# EAGLE design wireless-dong-mk-2.1 (EAGLE 6.5.0)
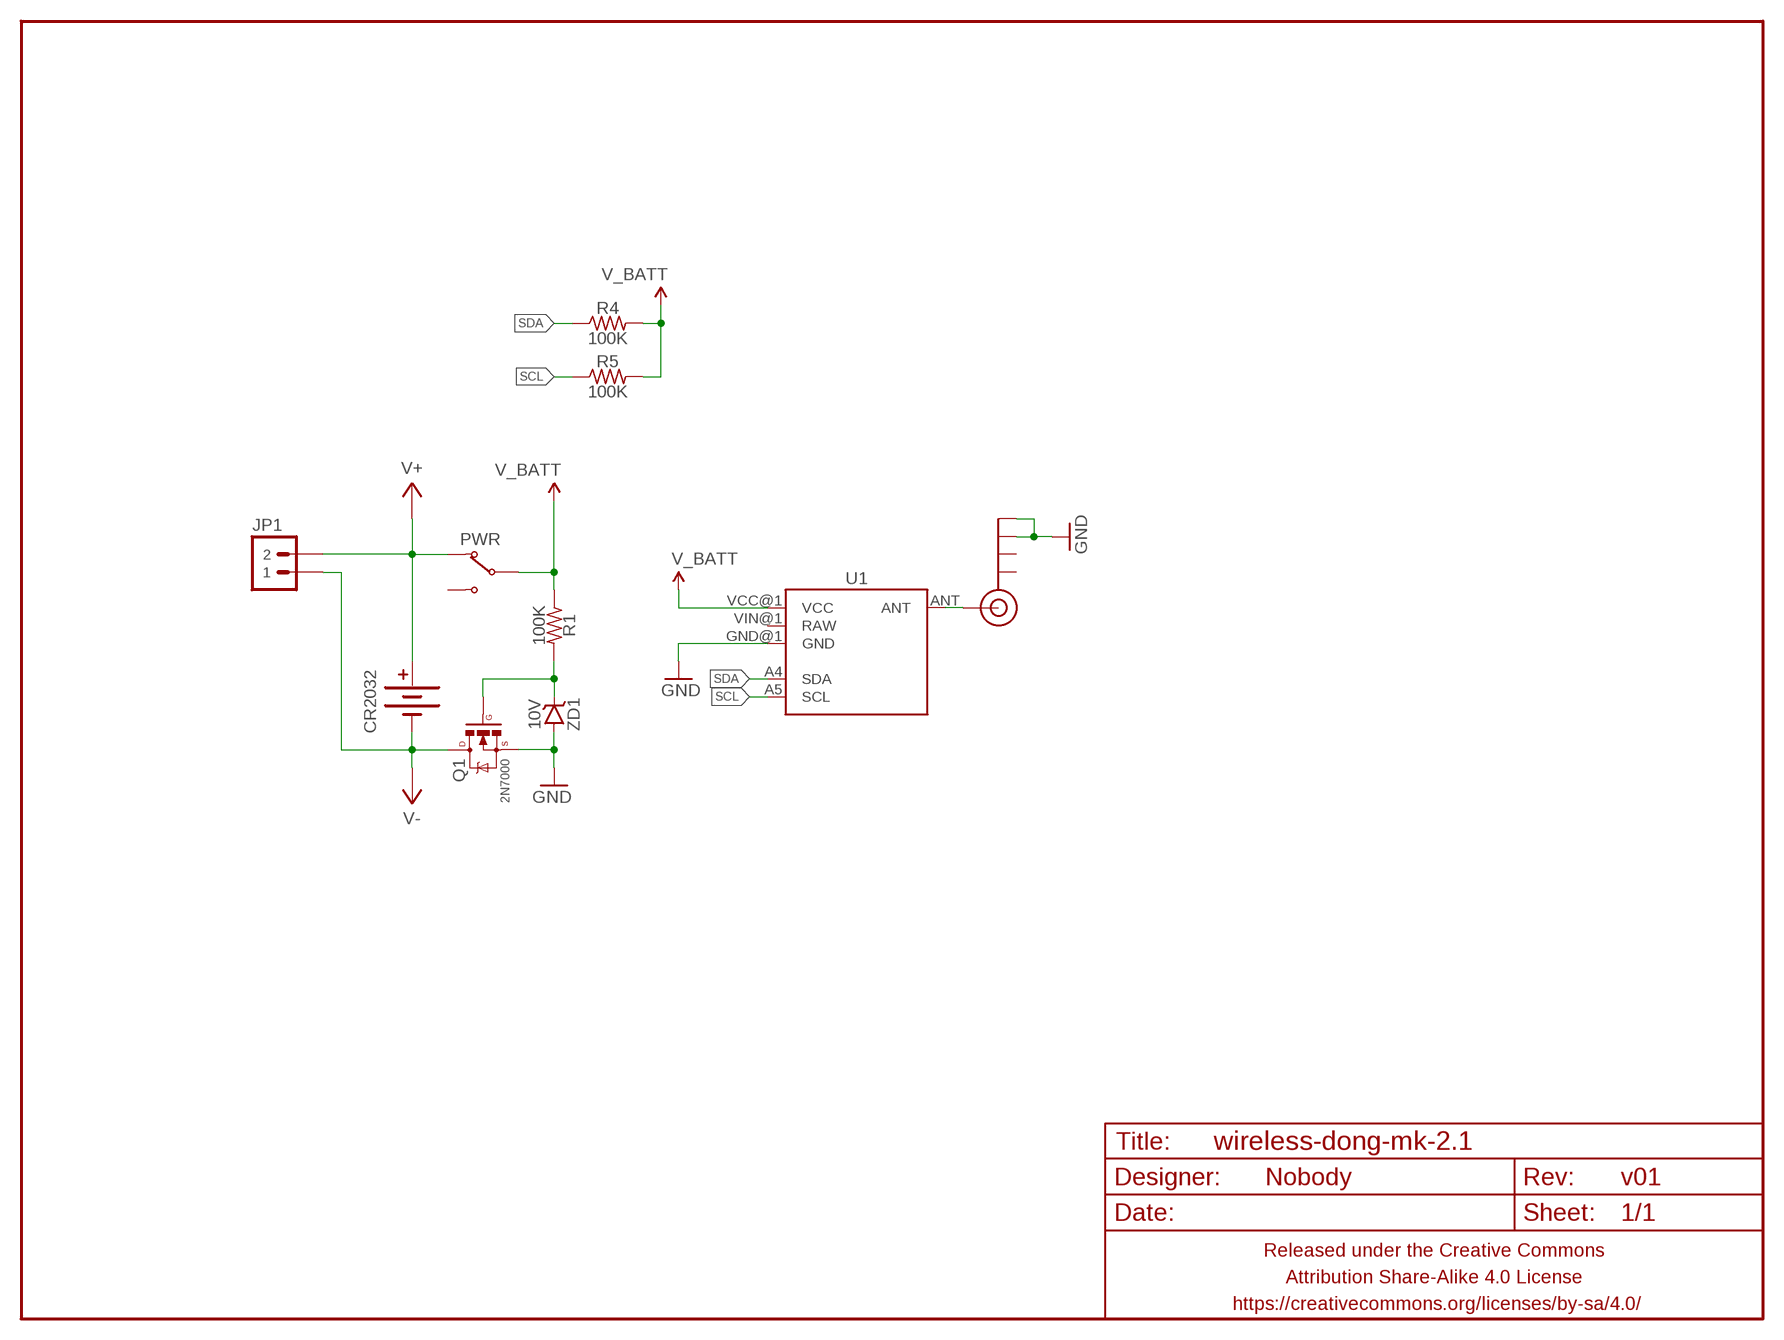
[diagram p0: schematic, sheet 1]

## Parts
ANT  SMA_EDGE  [SMA-EDGE]
CR2032  BATTERY20PTH_TOPLOAD  [BATTCON_20MM_PTH_TOPLOAD]
FRAME1  FRAME-LETTERNO_PACKAGE  [DUMMY]
JP1  M02PTH-CENTERED-R+  [1X02-CENTER-R+]
PWR  SWITCH-SPDTPTH-RA-2.54MM  [SPDT-RA-2.54MM]
Q1  2N7000  MOSFET-NCHANNELIRLML2502  [SOT23]
R1  100K  RESISTORR0603  [R0603]
R4  100K  RESISTORR0603  [R0603]
R5  100K  RESISTORR0603  [R0603]
U1  MOTEINO_BOAT  [MOTEINO_BOAT]
ZD1  10V  DIODE-ZENERSOT23  [SOT23]

## Nets
GND: ANT.GND@2(GND) ANT.GND@3(GND) Q1.2(S) U1.GND@1(GND) ZD1.1(A) ZD1.2(A)
N$1: Q1.1(G) R1.2 ZD1.3(C)
N$2: ANT.SIG(SIGNAL) U1.ANT
SCL: R5.1 U1.A5(SCL)
SDA: R4.1 U1.A4(SDA)
V+: CR2032.+ JP1.2 PWR.1(NC)
V-: CR2032.- JP1.1 Q1.3(D)
V_BATT: PWR.2(COM) R1.1 R4.2 R5.2 U1.VCC@1(VCC)
Unconnected: ANT.GND@0(GND) ANT.GND@1(GND) PWR.3(NO) U1.VIN@1(RAW)

## Library data of the parts
ANT = A_butts:SMA_EDGE: SMA Antenna Connector End launch SMA connector. The paste layer has been removed so that the connector can be hand soldered onto the board after reflow.
CR2032 = A_butts:BATTERY: Battery Holders Various common sizes : AA, AAA, 20mm coin cell and 12mm coin cell. 20MM_4LEGS, BATT-10373
FRAME1 = A_butts:FRAME-LETTER: Schematic Frame Standard 8.5x11 US Letter frame; DESIGNER: Nobody; VERSION: v01
JP1 = A_butts:M02: Standard 2-pin 0.1" header. Use with - straight break away headers ( PRT-00116) - right angle break away headers (PRT-00553) - swiss pins (PRT-00743) - machine pins (PRT-00117) - female headers (PRT-00115) Molex polarized connector foot print use with: PRT-08233 with associated crimp pins and housings. 2.54_SCREWTERM for use with PRT-10571. 3.5mm Screw Terminal footprints for PRT-08084 5mm Screw Terminal footprints for use with PRT-08433
PWR = A_butts:SWITCH-SPDT
Q1 = A_butts:MOSFET-NCHANNEL: Common NMOSFET Parts MFG P/N Store ID Prod ID FDD8780 TRANS-09984 SI7820DN TRANS-11055 FDS6630A IC-08089 2N7002PW TRANS-11151 FQP30N06L COM-10213 TRANS-10060 BSS123LT1G TRANS-08345 BSS138 TRANS-00830 BS170 2N7000
R1 R4 R5 = A_butts:RESISTOR: RESISTOR, American symbol
U1 = A_butts:MOTEINO_BOAT
ZD1 = A_butts:DIODE-ZENER: Zener Diode Production Part - 8199 3.4V Zener Voltage

## Board
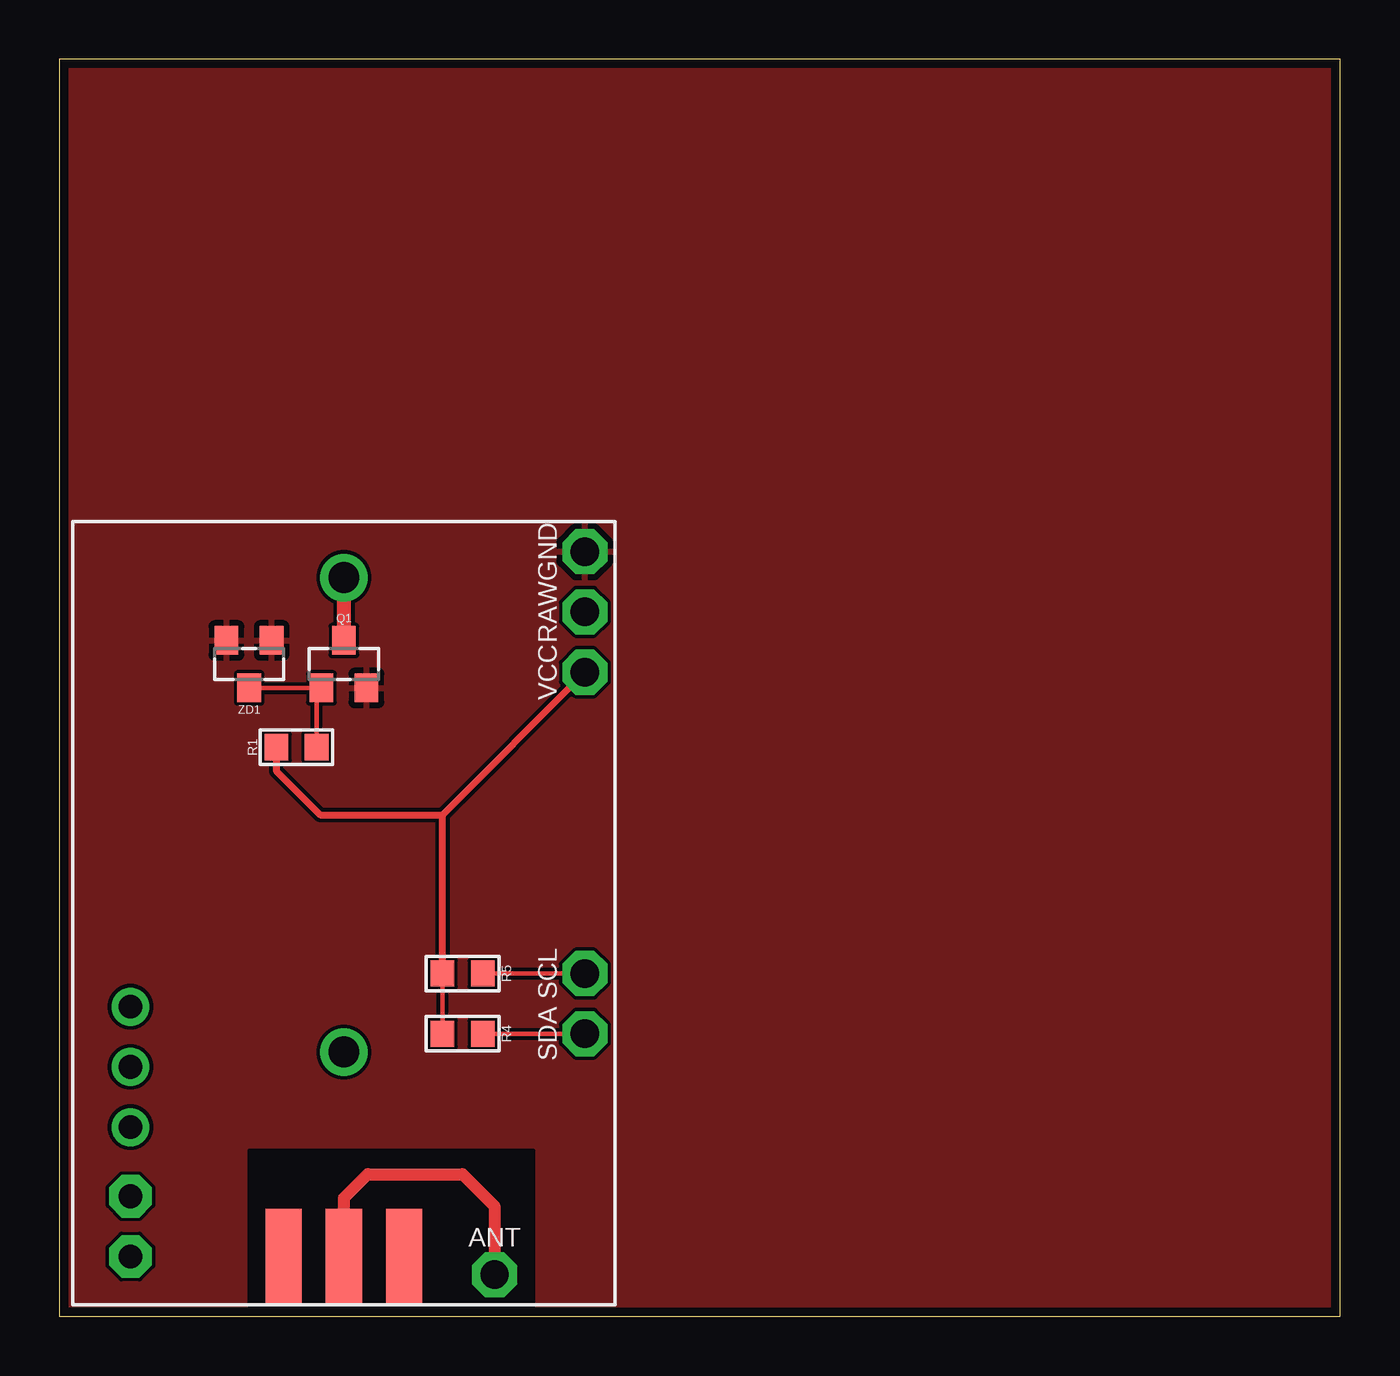
[diagram p1: board, top side]
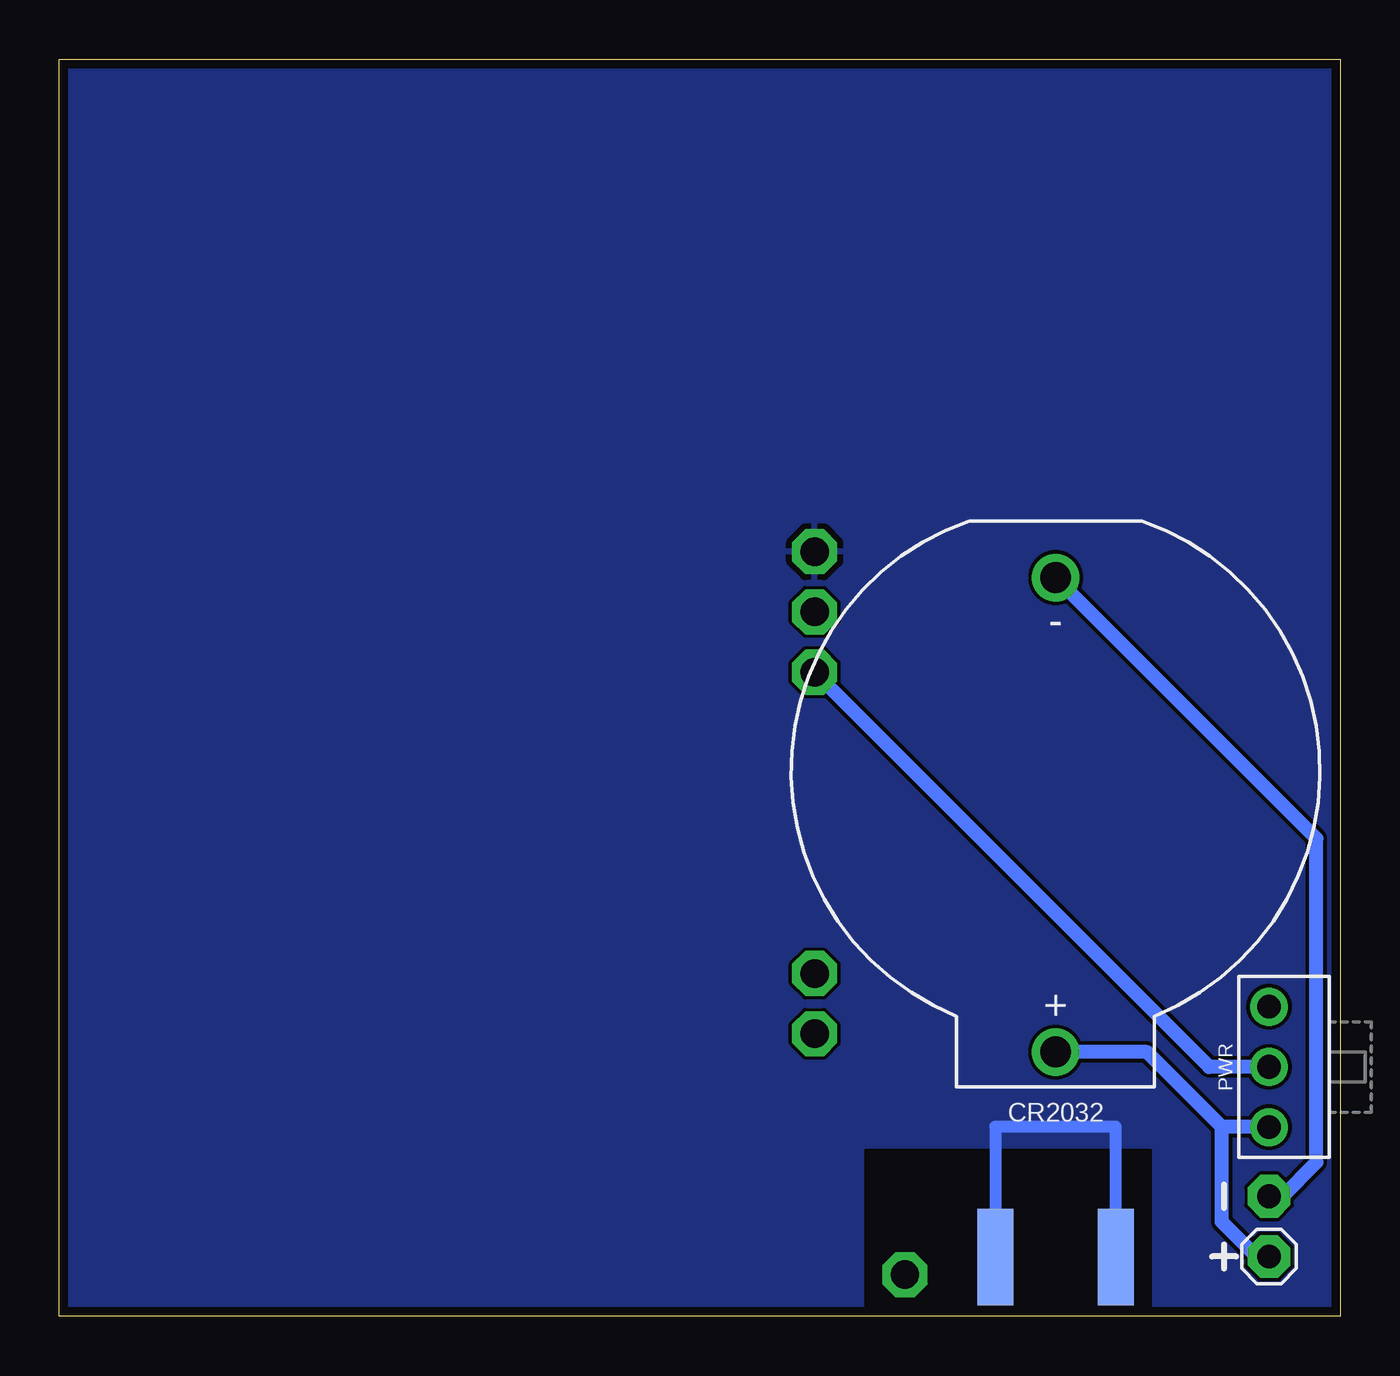
[diagram p2: board, bottom side, seen from below]

Size 54 x 53 mm. Coordinates in mm from the lower left corner, seen from the top.
Outline: 0,0 54,0 54,53 0,53 0,0
Copper layers (1*16): Top 0.0356mm / dielectric 1.5011mm / Bottom 0.0356mm
Design rules "LaenPCBOrder_2": minimum track width 6mil, minimum drill 13mil, track to track 6mil, track to pad 6mil, pad to pad 6mil, via to via 6mil, smd to smd 6mil, copper to edge 15mil, drill to drill 6mil, minimum pad ring 7mil, minimum via ring 7mil, stop-mask expansion 3mil, vias tented up to drill 20mil, thermal gap 10mil

### Footprints (pad centres in the part's own frame; a part is rotated, then mirrored left to right if it is on the bottom)
SMA-EDGE = smd 1.524 x 4.064: GND@0 -2.54,0; GND@1 2.54,0; SIG 0,0 | smd 1.524 x 4.064 bottom: GND@2 -2.54,0; GND@3 2.54,0
BATTCON_20MM_PTH_TOPLOAD = drill 1.3 pad 2: + 11.85,0; - -8.15,0
1X02-CENTER-R+ = drill 1 pad 1.8 octagon: 1 -1.27,0; 2 1.27,0
SPDT-RA-2.54MM = drill 1 pad 1.6: 1 0,0; 2 2.54,0; 3 5.08,0
SOT23 = smd 1 x 1.2: 1 -0.95,-1; 2 0.95,-1; 3 0,1
R0603 = smd 1 x 1.1: 1 -0.85,0; 2 0.85,0
MOTEINO_BOAT = drill 1.2 pad 1.9 octagon: A4 10.16,-5.08; A5 10.16,-2.54; ANT 6.35,-15.24; GND@1 10.16,15.24; VCC@1 10.16,10.16; VIN@1 10.16,12.7

### Placement (x,y rotation side)
ANT  12,2.5 0 top
CR2032  12,23 270 bottom
FRAME1  0,0 0 top
JP1  3,3.8 270 bottom
PWR  3,7.98 90 bottom
Q1  12,27.5 0 top
R1  10,24 0 top
R4  17,11.92 180 top
R5  17,14.46 180 top
U1  12,17 0 top
ZD1  8,27.5 180 top

### Tracks (layer width: path | path; a pad name or v marks a point on that pad's centre or on a via)
GND
  Bottom 0.5: ANT.GND@2 9.46,8 14.54,8 ANT.GND@3
  pour Top: -0.1,-0.1 -0.1,53.1 54.1,53.1 54.1,-0.1
  pour Bottom: -0.1,-0.1 -0.1,53.1 54.1,53.1 54.1,-0.1
N$1
  Top 0.2: ZD1.3 Q1.1 10.85,26.3 R1.2
N$2
  Top 0.5: ANT.SIG 12,5 13,6 17,6 18.35,4.65 U1.ANT
N$3
  cutout Top: 8,0 8,7 20,7 20,0
N$4
  cutout Bottom: 8,0 8,7 20,7 20,0
SCL
  Top 0.2: R5.1 U1.A5
SDA
  Top 0.2: R4.1 U1.A4
V+
  Bottom 0.6: JP1.2 3.53,2.53 5,4 5,8 | 5,8 8.15,11.15 CR2032.+ | PWR.1 3.02,8 5,8
V-
  Top 0.6: Q1.3 CR2032.-
  Bottom 0.6: JP1.1 2.43,5.07 1,6.5 1,20.15 CR2032.-
V_BATT
  Top 0.2: R4.2 R5.2
  Top 0.3: R5.2 16.15,21.15 | 16.15,21.15 U1.VCC@1 | R1.1 9.15,23 11,21.15 16.15,21.15
  Bottom 0.6: PWR.2 5.52,10.52 U1.VCC@1